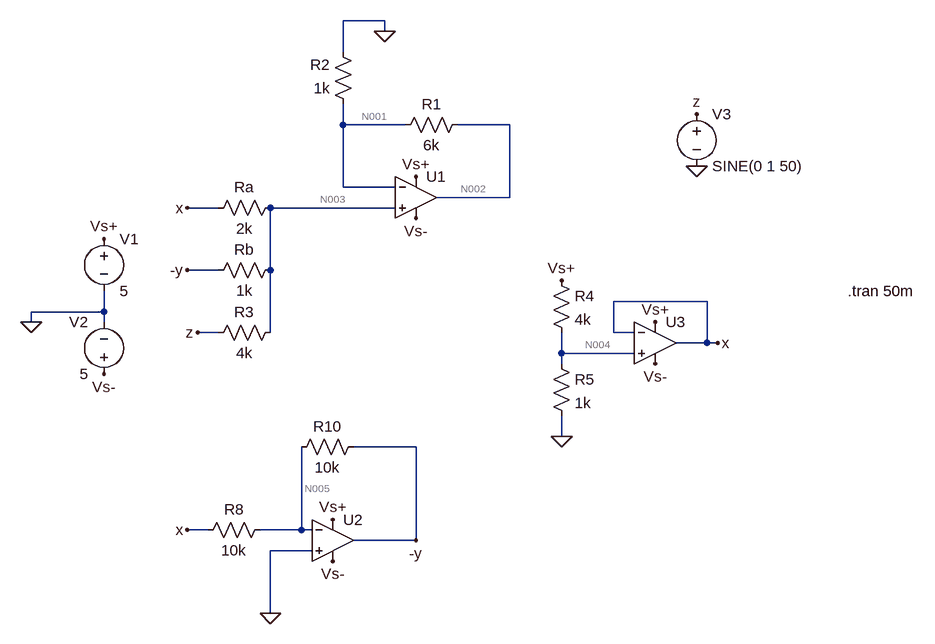
[diagram p0: schematic Task 1.asc]
Task 1.asc, the LTspice schematic file:
Version 4.1
SHEET 1 880 680
WIRE -192 -544 -256 -544
WIRE -192 -528 -192 -544
WIRE -256 -496 -256 -544
WIRE -256 -384 -256 -416
WIRE -160 -384 -256 -384
WIRE 0 -384 -80 -384
WIRE -256 -288 -256 -384
WIRE -176 -288 -256 -288
WIRE 0 -272 0 -384
WIRE 0 -272 -112 -272
WIRE -448 -256 -496 -256
WIRE -176 -256 -368 -256
WIRE -448 -160 -496 -160
WIRE -368 -160 -368 -256
WIRE 304 -112 160 -112
WIRE -624 -96 -624 -128
WIRE -624 -96 -736 -96
WIRE -736 -80 -736 -96
WIRE -624 -80 -624 -96
WIRE -448 -64 -480 -64
WIRE -368 -64 -368 -160
WIRE 160 -64 160 -112
WIRE 192 -64 160 -64
WIRE 304 -48 304 -112
WIRE 304 -48 256 -48
WIRE 320 -48 304 -48
WIRE 80 -32 80 -64
WIRE 192 -32 80 -32
WIRE 80 -16 80 -32
WIRE 80 96 80 64
WIRE -144 112 -240 112
WIRE -464 240 -496 240
WIRE -320 240 -320 112
WIRE -320 240 -384 240
WIRE -304 240 -320 240
WIRE -144 256 -144 112
WIRE -144 256 -240 256
WIRE -304 272 -368 272
WIRE -368 368 -368 272
FLAG -144 -304 Vs+
FLAG -144 -240 Vs-
FLAG -736 -80 0
FLAG -624 -208 Vs+
FLAG -624 0 Vs-
FLAG -496 -256 x
FLAG -496 -160 -y
FLAG -480 -64 z
FLAG -192 -528 0
FLAG 288 -320 0
FLAG 80 96 0
FLAG 80 -144 Vs+
FLAG 320 -48 x
FLAG -272 224 Vs+
FLAG -272 288 Vs-
FLAG -368 368 0
FLAG -144 256 -y
FLAG -496 240 x
FLAG 288 -400 z
FLAG 224 -80 Vs+
FLAG 224 -16 Vs-
SYMBOL voltage -624 -224 R0
WINDOW 123 0 0 Left 0
WINDOW 39 0 0 Left 0
SYMATTR InstName V1
SYMATTR Value 5
SYMBOL voltage -624 16 R180
WINDOW 0 24 96 Left 2
WINDOW 3 24 16 Left 2
WINDOW 123 0 0 Left 0
WINDOW 39 0 0 Left 0
SYMATTR InstName V2
SYMATTR Value 5
SYMBOL res -352 -272 R90
WINDOW 0 0 56 VBottom 2
WINDOW 3 32 56 VTop 2
SYMATTR InstName Ra
SYMATTR Value 2k
SYMBOL res -352 -176 R90
WINDOW 0 0 56 VBottom 2
WINDOW 3 32 56 VTop 2
SYMATTR InstName Rb
SYMATTR Value 1k
SYMBOL res -352 -80 R90
WINDOW 0 0 56 VBottom 2
WINDOW 3 32 56 VTop 2
SYMATTR InstName R3
SYMATTR Value 4k
SYMBOL OpAmps\\UniversalOpAmp -144 -272 R0
SYMATTR InstName U1
SYMBOL res -64 -400 R90
WINDOW 0 0 56 VBottom 2
WINDOW 3 32 56 VTop 2
SYMATTR InstName R1
SYMATTR Value 6k
SYMBOL res -240 -400 R180
WINDOW 0 36 76 Left 2
WINDOW 3 36 40 Left 2
SYMATTR InstName R2
SYMATTR Value 1k
SYMBOL voltage 288 -416 R0
WINDOW 123 0 0 Left 0
WINDOW 39 0 0 Left 0
SYMATTR InstName V3
SYMATTR Value SINE(0 1 50)
SYMBOL res 64 -160 R0
SYMATTR InstName R4
SYMATTR Value 4k
SYMBOL res 64 -32 R0
SYMATTR InstName R5
SYMATTR Value 1k
SYMBOL OpAmps\\UniversalOpAmp -272 256 R0
SYMATTR InstName U2
SYMBOL res -368 224 R90
WINDOW 0 0 56 VBottom 2
WINDOW 3 32 56 VTop 2
SYMATTR InstName R8
SYMATTR Value 10k
SYMBOL res -336 128 R270
WINDOW 0 32 56 VTop 2
WINDOW 3 0 56 VBottom 2
SYMATTR InstName R10
SYMATTR Value 10k
SYMBOL OpAmps\\UniversalOpAmp 224 -48 R0
SYMATTR InstName U3
TEXT 520 -128 Left 2 !.tran 50m

The netlist it stands for:
* Task 1.asc
V1 Vs+ 0 5
V2 Vs- 0 5
Ra N003 x 2k
Rb N003 -y 1k
R3 N003 z 4k
X§U1 N003 N001 Vs+ Vs- N002 level1 Avol=1Meg GBW=10Meg Vos=0 En=0 Enk=0 In=0 Ink=0 Rin=500Meg  ; pins In+ In- V+ V- OUT
R1 N002 N001 6k
R2 N001 0 1k
V3 z 0 SINE(0 1 50)
R4 Vs+ N004 4k
R5 N004 0 1k
X§U2 0 N005 Vs+ Vs- -y level1 Avol=1Meg GBW=10Meg Vos=0 En=0 Enk=0 In=0 Ink=0 Rin=500Meg  ; pins In+ In- V+ V- OUT
R8 N005 x 10k
R10 N005 -y 10k
X§U3 N004 x Vs+ Vs- x level1 Avol=1Meg GBW=10Meg Vos=0 En=0 Enk=0 In=0 Ink=0 Rin=500Meg  ; pins In+ In- V+ V- OUT
.tran 50m
.lib UniversalOpAmp1.lib
.backanno
.end

* Results of the author's LTspice run, read from the files saved beside the schematic
* Operating Point, zero values left out:
*   V(-y) = -1 V
*   V(n001) = -285.8 mV
*   V(n002) = -2 V
*   V(n003) = -285.8 mV
*   V(n004) = 1 V
*   V(n005) = 1 µV
*   V(vs+) = 5 V
*   V(vs-) = 5 V
*   V(x) = 1 V
*   I(R1) = -285.8 µA
*   I(R10) = 100 µA
*   I(R2) = -285.8 µA
*   I(R3) = -71.44 µA
*   I(R4) = 1 mA
*   I(R5) = 1 mA
*   I(R8) = -100 µA
*   I(Ra) = -642.9 µA
*   I(Rb) = 714.3 µA
*   I(V1) = -1 mA
*   I(V2) = -28.57 nA
*   I(V3) = -71.44 µA
*   Ix(u1:1) = -10.57 nA
*   Ix(u1:2) = -10.57 nA
*   Ix(u1:3) = 10.57 nA
*   Ix(u1:4) = 10.57 nA
*   Ix(u1:5) = 285.8 µA
*   Ix(u2:1) = -10 nA
*   Ix(u2:2) = -10 nA
*   Ix(u2:3) = 10 nA
*   Ix(u2:4) = 10 nA
*   Ix(u2:5) = 814.3 µA
*   Ix(u3:1) = -8 nA
*   Ix(u3:2) = -8 nA
*   Ix(u3:3) = 8 nA
*   Ix(u3:4) = 8 nA
*   Ix(u3:5) = -742.9 µA
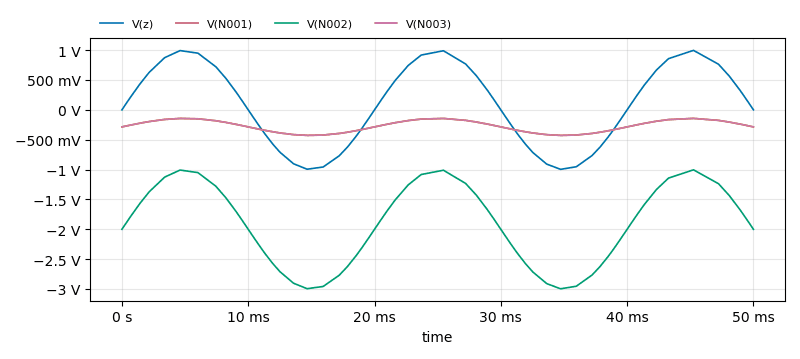
[diagram p1: Transient Analysis of Task 1.asc, plotted from the saved traces]
* Transient Analysis, 1 run:
*   V(z): min -996.5 mV, max 995.9 mV, average 123.1 mV, rms 699.7 mV, last 0 V
*   V(N001): min -428.1 mV, max -143.5 mV, average -268.2 mV, rms 285.7 mV, last -285.8 mV
*   V(N002): min -2.997 V, max -1.004 V, average -1.877 V, rms 2 V, last -2 V
*   V(N003): min -428.1 mV, max -143.5 mV, average -268.2 mV, rms 285.7 mV, last -285.8 mV